# Altium project UP-Buzzer.PrjPcb
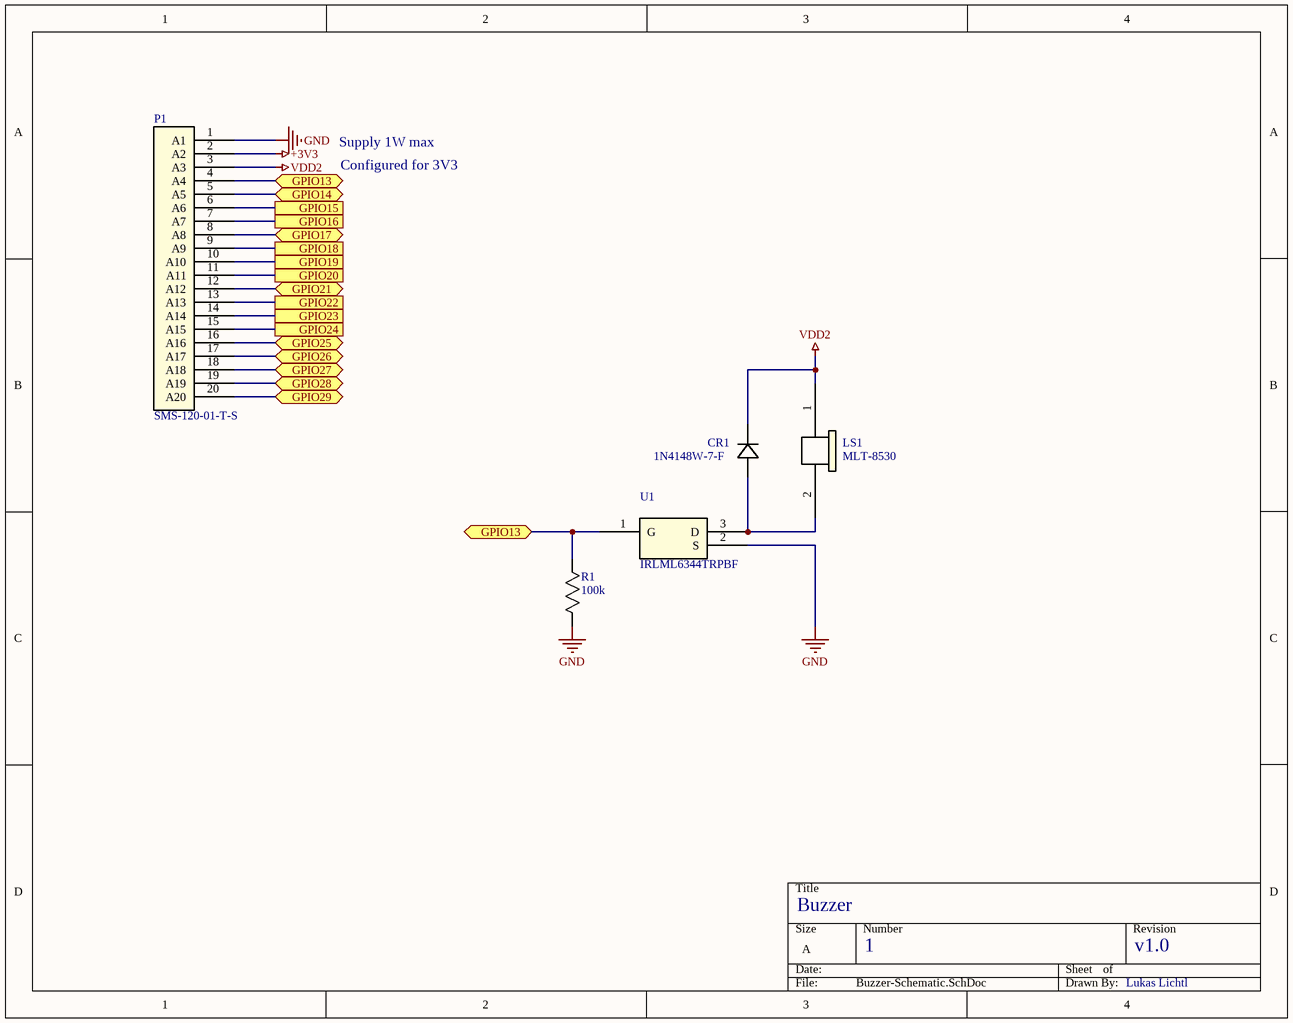
[diagram p0: Buzzer-Schematic.SchDoc]
3 sheets, 22 parts. Net scope: flat (ports and power ports of the same name join across sheets).
Board file: UP-Buzzer-PCB.PcbDoc
Sheets:
  Buzzer-Schematic.SchDoc
  Proximity-Sensor-Schematic.SchDoc
  Isolated-Inputs-Schematic.SchDoc

## Sheet Buzzer-Schematic.SchDoc
size A; SheetNumber: 1

### Parts
CR1  1N4148W-7-F  [SOD123_DIO]
LS1  MLT-8530  [MLT-8530_JHE]
P1  SMS-120-01-T-S  [SMS-S-120]
R1  100k  [RC0603N_YAG]
U1  IRLML6344TRPBF  [IRLML6344TRPBF_INF]

### Ports
GPIO13 (bidir), GPIO14 (bidir), GPIO15, GPIO16, GPIO17 (bidir), GPIO18, GPIO19, GPIO20, GPIO21 (bidir), GPIO22, GPIO23, GPIO24, GPIO25 (bidir), GPIO26 (bidir), GPIO27 (bidir), GPIO28 (bidir), GPIO29 (bidir)

### Nets
+3V3: P1.2(A2)
GND: P1.1(A1) R1.1 U1.2(S)
VDD2: CR1.1 LS1.1 P1.3(A3)
NetCR1_2: CR1.2 LS1.2 U1.3(D)
NetP1_4: P1.4(A4) R1.2 U1.1(G) ; port GPIO13
NetP1_5: P1.5(A5) ; port GPIO14
NetP1_6: P1.6(A6) ; port GPIO15
NetP1_7: P1.7(A7) ; port GPIO16
NetP1_8: P1.8(A8) ; port GPIO17
NetP1_9: P1.9(A9) ; port GPIO18
NetP1_10: P1.10(A10) ; port GPIO19
NetP1_11: P1.11(A11) ; port GPIO20
NetP1_12: P1.12(A12) ; port GPIO21
NetP1_13: P1.13(A13) ; port GPIO22
NetP1_14: P1.14(A14) ; port GPIO23
NetP1_15: P1.15(A15) ; port GPIO24
NetP1_16: P1.16(A16) ; port GPIO25
NetP1_17: P1.17(A17) ; port GPIO26
NetP1_18: P1.18(A18) ; port GPIO27
NetP1_19: P1.19(A19) ; port GPIO28
NetP1_20: P1.20(A20) ; port GPIO29

### Notes on the sheet
- Supply 1W max
- Configured for 3V3
- Buzzer
- 1
- v1.0
- Lukas Lichtl

### Library data of the parts
CR1 = 1N4148W-7-F: No Description Available; Mfr_Name: Diodes Inc
LS1 = MLT-8530: No Description Available; Mfr_Name: Jiangsu Huaneng Elec; RefDes: RefDes; Type: Type
P1 = SMS-120-01-T-S: No Description Available; Mfr_Name: Samtec Inc; RefDes: RefDes; Type: Type
R1 = RC0603FR-07470RL: No Description Available; Mfr_Name: Yageo
U1 = IRLML6344TRPBF: No Description Available; Mfr_Name: Infineon; RefDes: RefDes; Type: Type

## Sheet Proximity-Sensor-Schematic.SchDoc
size A; SheetNumber: 2
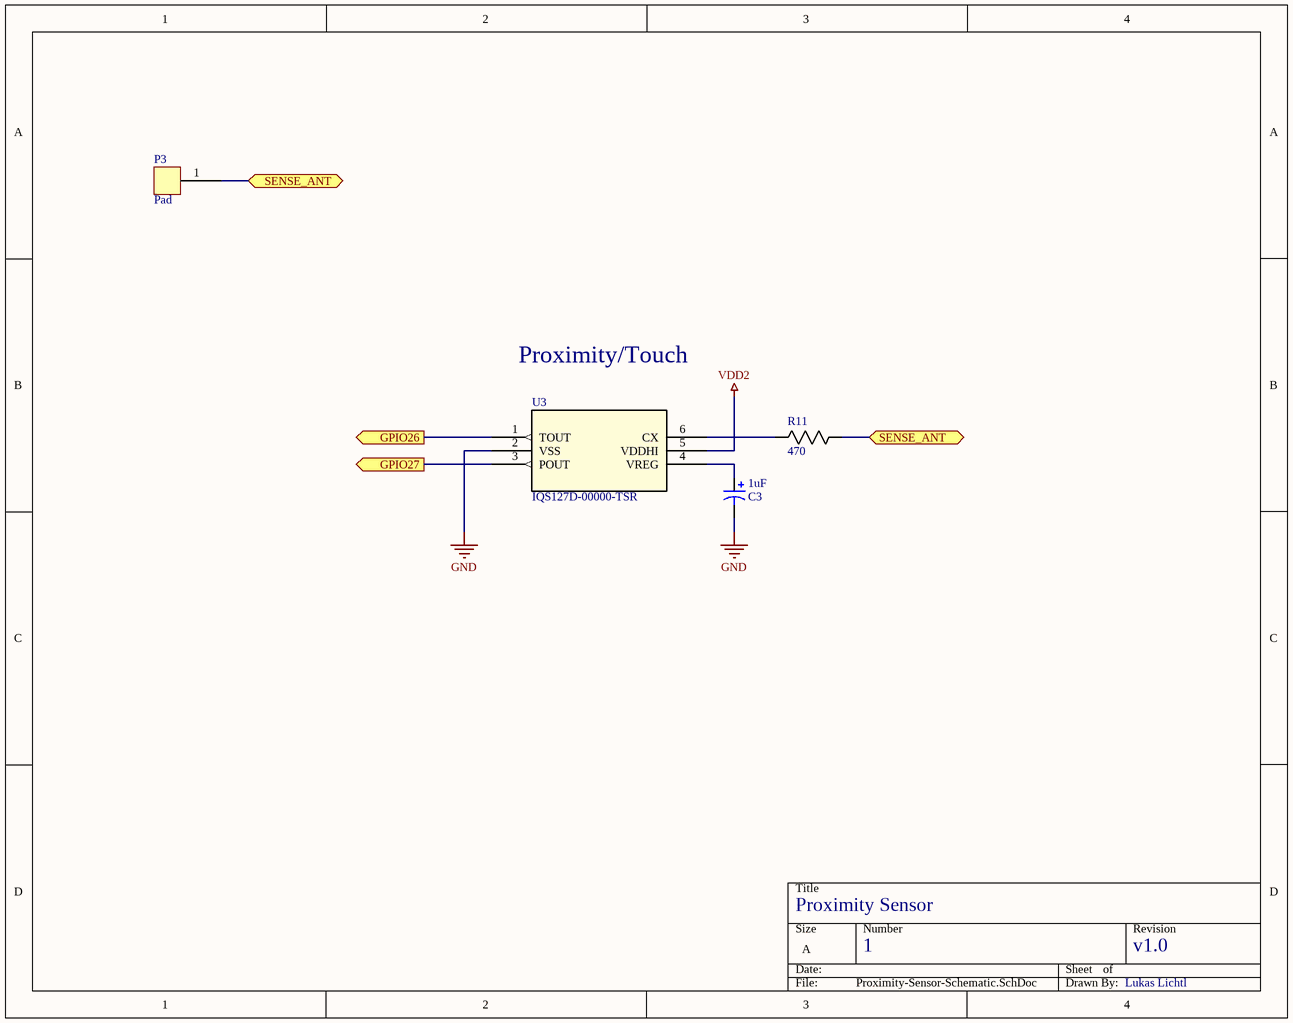
[diagram p1: Proximity-Sensor-Schematic.SchDoc]

### Parts
C3  value 1uF  [C0805]  (hidden comment: Cap Pol3)
P3  Pad  [Simple-PAD-PCB]
R11  470  [RC0603N_YAG]
U3  IQS127D-00000-TSR  [TSOT23-6_AZQ]

### Ports
GPIO26 (out), GPIO27 (out), SENSE_ANT (bidir)

### Nets
GND: C3.2 U3.2(VSS)
VDD2: U3.5(VDDHI)
NetC3_1: C3.1 U3.4(VREG)
NetP1_17: U3.1(TOUT) ; port GPIO26
NetP1_18: U3.3(POUT) ; port GPIO27
NetP3_1: P3.1 R11.1 ; port SENSE_ANT
NetR11_2: R11.2 U3.6(CX)

### Notes on the sheet
- Proximity/Touch
- Proximity Sensor
- 1
- v1.0
- Lukas Lichtl

### Library data of the parts
C3 = Cap Pol3: Polarized Capacitor (Surface Mount); Published: 8-Jun-2000; LatestRevisionDate: 29-May-2009; LatestRevisionNote: IPC-7351 Footprint Added.; PackageReference: C0805; Publisher: Altium Limited; PackageDescription: Chip Capacitor
R11 = RC0603FR-07470RL: as R1 on sheet Buzzer-Schematic
U3 = IQS127D-00000-TSR: No Description Available; Mfr_Name: Azoteq; RefDes: RefDes; Type: Type

## Sheet Isolated-Inputs-Schematic.SchDoc
size A; SheetNumber: 3
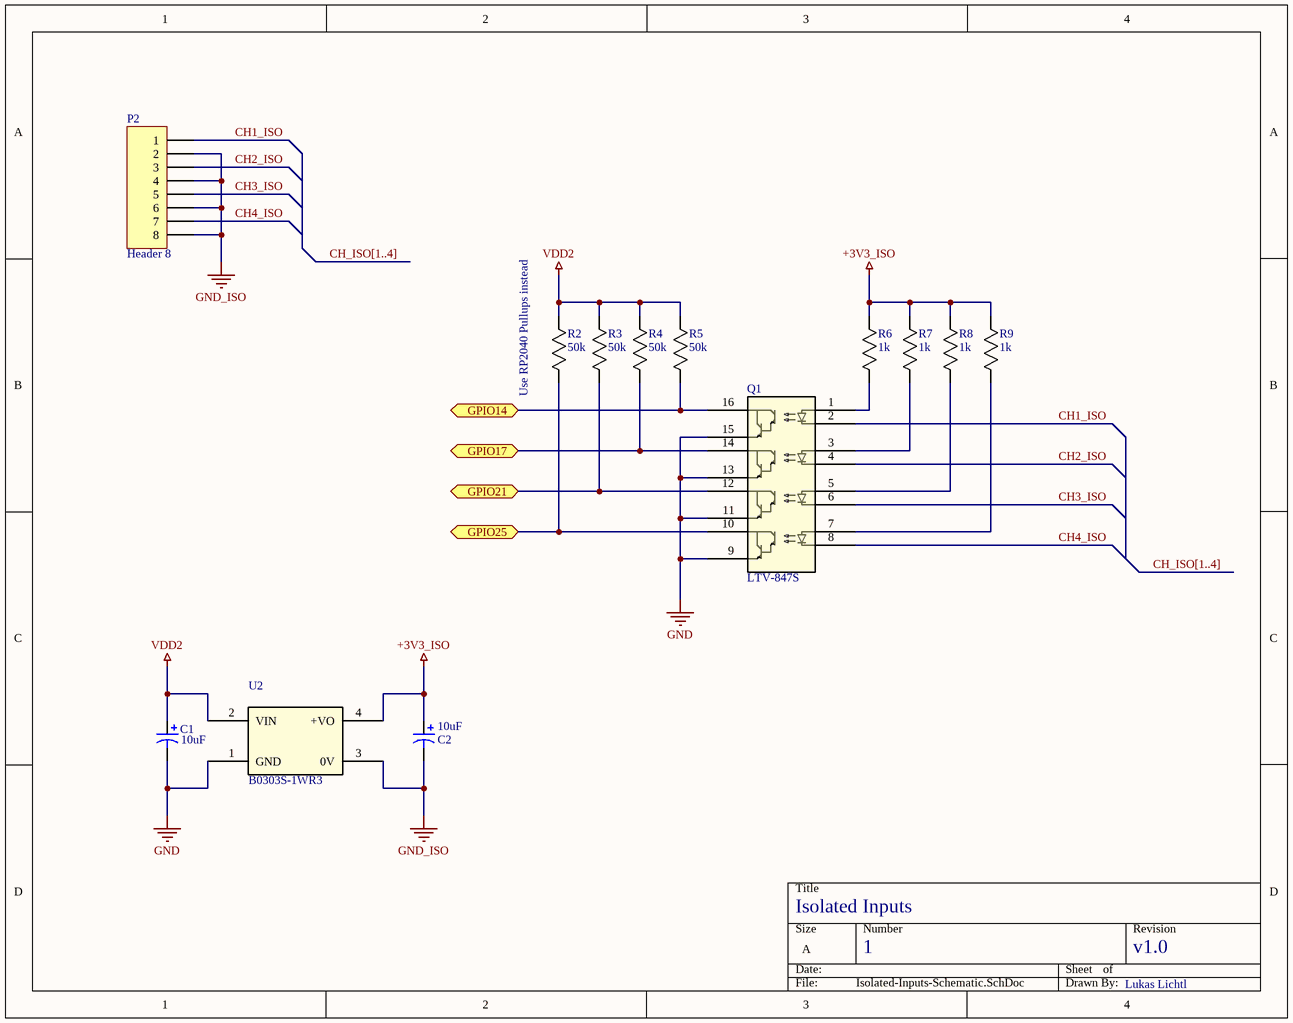
[diagram p2: Isolated-Inputs-Schematic.SchDoc]

### Parts
C1  value 10uF  [C0805]  (hidden comment: Cap Pol3)
C2  value 10uF  [C0805]  (hidden comment: Cap Pol3)
P2  Header 8  [HDR1X8]
Q1  LTV-847S  [LTV-847S_LTO]
R2  50k  [RC0603N_YAG]
R3  50k  [RC0603N_YAG]
R4  50k  [RC0603N_YAG]
R5  50k  [RC0603N_YAG]
R6  1k  [RC0603N_YAG]
R7  1k  [RC0603N_YAG]
R8  1k  [RC0603N_YAG]
R9  1k  [RC0603N_YAG]
U2  B0303S-1WR3  [SIP4_B_S-1WR3_MNS]

### Ports
GPIO14 (bidir), GPIO17 (bidir), GPIO21 (bidir), GPIO25 (bidir)

### Nets
+3V3_ISO: C2.1 R6.2 R7.2 R8.2 R9.2 U2.4(+VO)
GND: C1.2 Q1.9 Q1.11 Q1.13 Q1.15 U2.1(GND)
GND_ISO: C2.2 P2.2 P2.4 P2.6 P2.8 U2.3(0V)
VDD2: C1.1 R2.2 R3.2 R4.2 R5.2 U2.2(VIN)
CH1_ISO: P2.1 Q1.2
CH2_ISO: P2.3 Q1.4
CH3_ISO: P2.5 Q1.6
CH4_ISO: P2.7 Q1.8
NetP1_5: Q1.16 R5.1 ; port GPIO14
NetP1_8: Q1.14 R4.1 ; port GPIO17
NetP1_12: Q1.12 R3.1 ; port GPIO21
NetP1_16: Q1.10 R2.1 ; port GPIO25
NetQ1_1: Q1.1 R6.1
NetQ1_3: Q1.3 R7.1
NetQ1_5: Q1.5 R8.1
NetQ1_7: Q1.7 R9.1

### Buses and harness runs
bus CH_ISO[1..4]

### Notes on the sheet
- (near R2) Use RP2040 Pullups instead
- Isolated Inputs
- 1
- v1.0
- Lukas Lichtl

### Library data of the parts
C1 C2 = Cap Pol3: Polarized Capacitor (Surface Mount); Published: 8-Jun-2000; LatestRevisionDate: 29-May-2009; LatestRevisionNote: IPC-7351 Footprint Added.; PackageReference: C0805; Publisher: Altium Limited; PackageDescription: Chip Capacitor
P2 = Header 8: Header, 8-Pin; LatestRevisionDate: 17-Jul-2002; LatestRevisionNote: Re-released for DXP Platform.; Publisher: Altium Limited
Q1 = LTV-847S: No Description Available; Mfr_Name: LITE-ON; RefDes: RefDes; Type: Type
R2-R4 R6-R9 = RC0603FR-07470RL: as R1 on sheet Buzzer-Schematic
R5 = RC0603FR-07470RL: Mfr_Name: Yageo

## Nets that join several sheets
GND: Buzzer-Schematic (P1.1 R1.1 U1.2), Proximity-Sensor-Schematic (C3.2 U3.2), Isolated-Inputs-Schematic (6 pins)
VDD2: Buzzer-Schematic (CR1.1 LS1.1 P1.3), Proximity-Sensor-Schematic (U3.5), Isolated-Inputs-Schematic (6 pins)
NetP1_5: Buzzer-Schematic (P1.5), Isolated-Inputs-Schematic (Q1.16 R5.1)
NetP1_8: Buzzer-Schematic (P1.8), Isolated-Inputs-Schematic (Q1.14 R4.1)
NetP1_12: Buzzer-Schematic (P1.12), Isolated-Inputs-Schematic (Q1.12 R3.1)
NetP1_16: Buzzer-Schematic (P1.16), Isolated-Inputs-Schematic (Q1.10 R2.1)
NetP1_17: Buzzer-Schematic (P1.17), Proximity-Sensor-Schematic (U3.1)
NetP1_18: Buzzer-Schematic (P1.18), Proximity-Sensor-Schematic (U3.3)